# EAGLE design led strip controller (EAGLE 9.5.2)
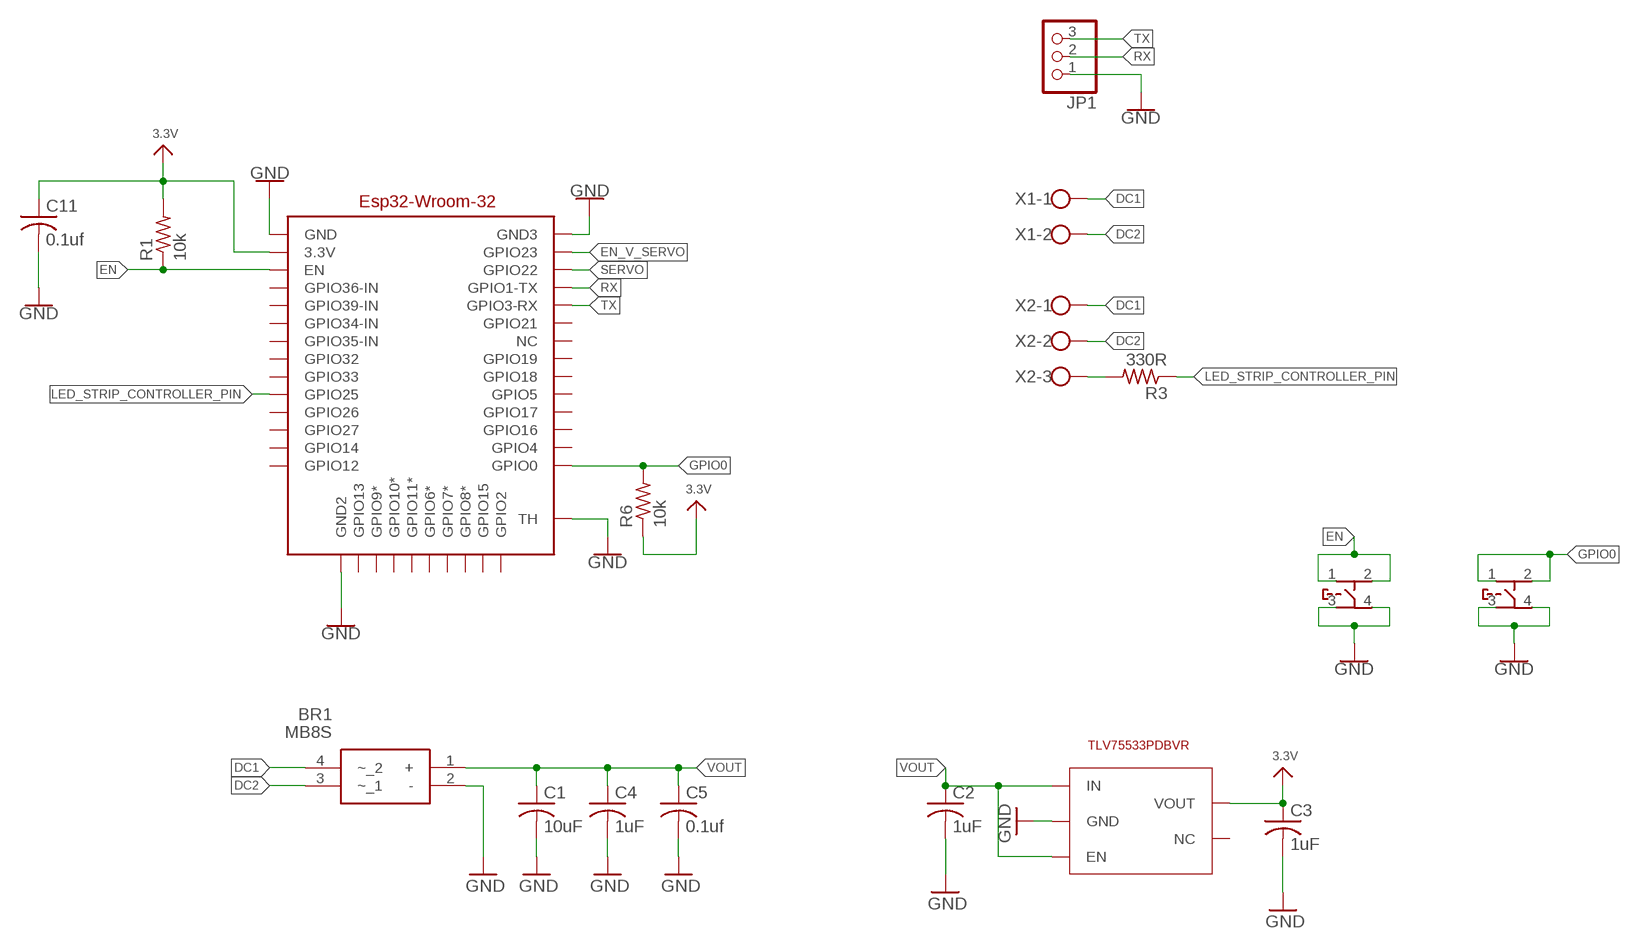
[diagram p0: schematic, sheet 1]

## Parts
BR1  MB8S  [SOP245P670X290-4N]
C1  10uF  C-USC1206  [C1206]
C2  1uF  C-USC0603  [C0603]
C3  1uF  C-USC0603  [C0603]
C4  1uF  C-USC0603  [C0603]
C5  0.1uf  C-USC0603  [C0603]
C11  0.1uf  C-USC0603  [C0603]
JP1  PINHD-1X3  [1X03]
R1  10k  R-US_R0603  [R0603]
R3  330R  R-US_R0603  [R0603]
R6  10k  R-US_R0603  [R0603]
U$1  ESP32-WROM-32  [ESP-32FOOTPRINT]
U$29  TLV75533PDBVR  [SOT-23-5]
U$33  XUNPU  [TS-1089S]
U$34  XUNPU  [TS-1089S]
X1  W237-102  [W237-102]
X2  W237-103  [W237-103]

## Nets
3.3V: C3.1 C11.1 R1.2 R6.1 U$1.3.3V U$29.VOUT
DC1: BR1.4(~_2) X1.1 X2.1
DC2: BR1.3(~_1) X1.2 X2.2
EN: R1.1 U$1.EN U$33.1 U$33.2
EN_V_SERVO: U$1.GPIO23
GND: BR1.2(-) C1.2 C2.2 C3.2 C4.2 C5.2 C11.2 JP1.1 U$1.GND U$1.GND2 U$1.GND3 U$1.TH U$29.GND U$33.3 U$33.4 U$34.3 U$34.4
GPIO0: R6.2 U$1.GPIO0 U$34.1 U$34.2
LED_STRIP_CONTROLLER_PIN: R3.1 U$1.GPIO25
N$1: R3.2 X2.3
RX: JP1.2 U$1.GPIO1(GPIO1-TX)
SERVO: U$1.GPO22(GPIO22)
TX: JP1.3 U$1.GPIO3(GPIO3-RX)
VOUT: BR1.1(+) C1.1 C2.1 C4.1 C5.1 U$29.EN U$29.IN
Unconnected: U$1.GPIO2 U$1.GPIO4 U$1.GPIO5 U$1.GPIO6(GPIO6*) U$1.GPIO7(GPIO7*) U$1.GPIO8(GPIO8*) U$1.GPIO9(GPIO9*) U$1.GPIO10(GPIO10*) U$1.GPIO11(GPIO11*) U$1.GPIO12 U$1.GPIO13 U$1.GPIO14 U$1.GPIO15 U$1.GPIO16 U$1.GPIO17 U$1.GPIO18 U$1.GPIO19 U$1.GPIO21 U$1.GPIO26 U$1.GPIO27 U$1.GPIO32 U$1.GPIO33 U$1.GPIO34(GPIO34-IN) U$1.GPIO35(GPIO35-IN) U$1.GPIO36(GPIO36-IN) U$1.GPIO39(GPIO39-IN) U$1.NC U$29.NC

## Notes on the sheet
- TLV75533PDBVR

## Library data of the parts
BR1 = MB8S:MB8S: ON Semiconductor MB8S, Bridge Rectifier, 500mA 800V, 4-Pin SOIC Source: Datasheet <https://www.onsemi.com/pub/Collateral/MB8S-D.PDF>; ARROW_PART_NUMBER: MB8S; ARROW_PRICE-STOCK: https://www.arrow.com/en/products/mb8s/on-semiconductor?region=nac; DESCRIPTION: ON Semiconductor MB8S, Bridge Rectifier, 500mA 800V, 4-Pin SOIC; HEIGHT: 2.9mm; MANUFACTURER_NAME: onsemi; MANUFACTURER_PART_NUMBER: MB8S; MOUSER_PART_NUMBER: 512-MB8S; MOUSER_PRICE-STOCK: https://www.mouser.co.uk/ProductDetail/ON-Semiconductor-Fairchild/MB8S?qs=5V%252BoiEcutOGeoeDaI1GueA%3D%3D
C1 = BeagleBone_Black_Wireless:C-US: CAPACITOR, American symbol
C2-C5 C11 = rcl:C-US: CAPACITOR, American symbol; SPICEPREFIX: C
JP1 = pinhead:PINHD-1X3: PIN HEADER
R1 R6 = adafruit:R-US_: RESISTOR, American symbol
R3 = rcl:R-US_: RESISTOR, American symbol; SPICEPREFIX: R
U$1 = Esp32-wrom-32:ESP32-WROM-32
U$29 = TLV75533PDBVR:TLV75533PDBVR
U$33 U$34 = TS-1089S-02526:XUNPU
X1 = con-wago-500:W237-102: WAGO SCREW CLAMP; MPN: 237-102; OC_FARNELL: unknown; OC_NEWARK: 70K9898
X2 = con-wago-500:W237-103: WAGO SCREW CLAMP; MPN: 237-103; OC_FARNELL: unknown; OC_NEWARK: 18M7116

## Board
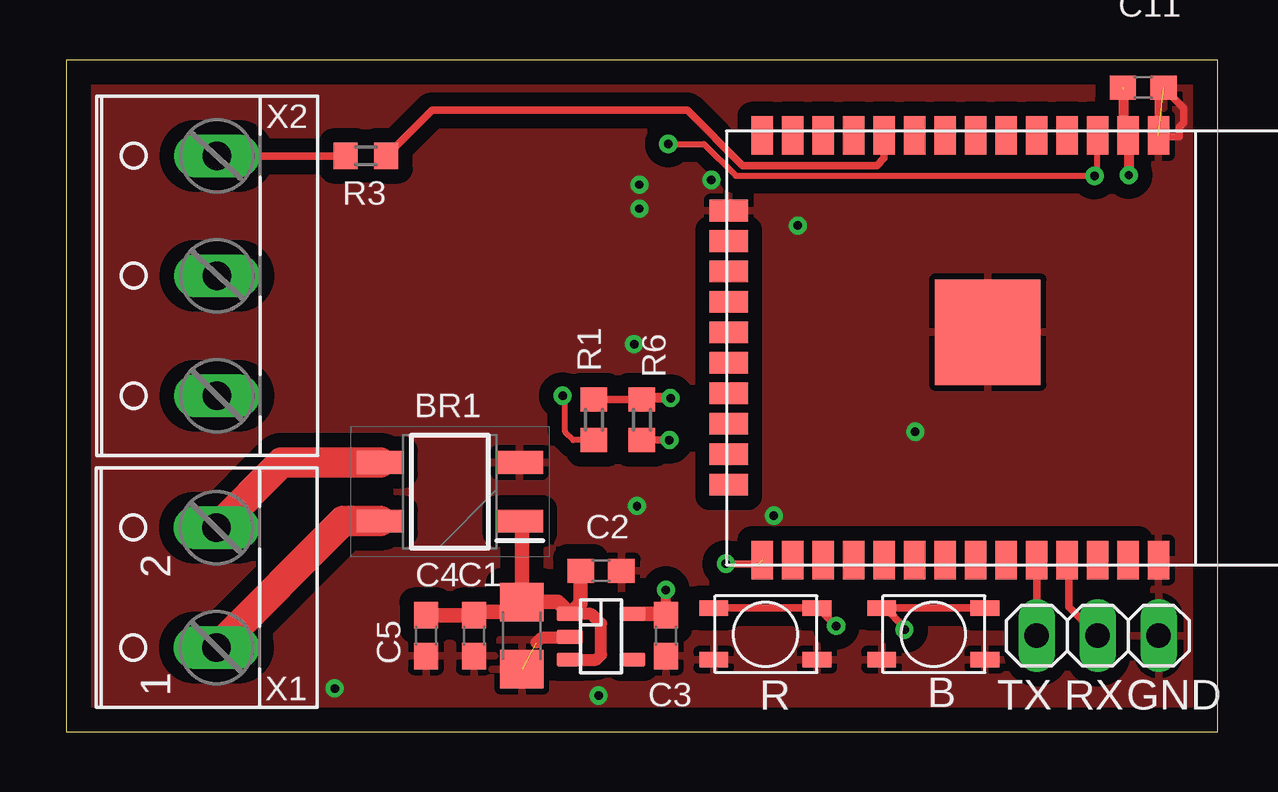
[diagram p1: board, top side]
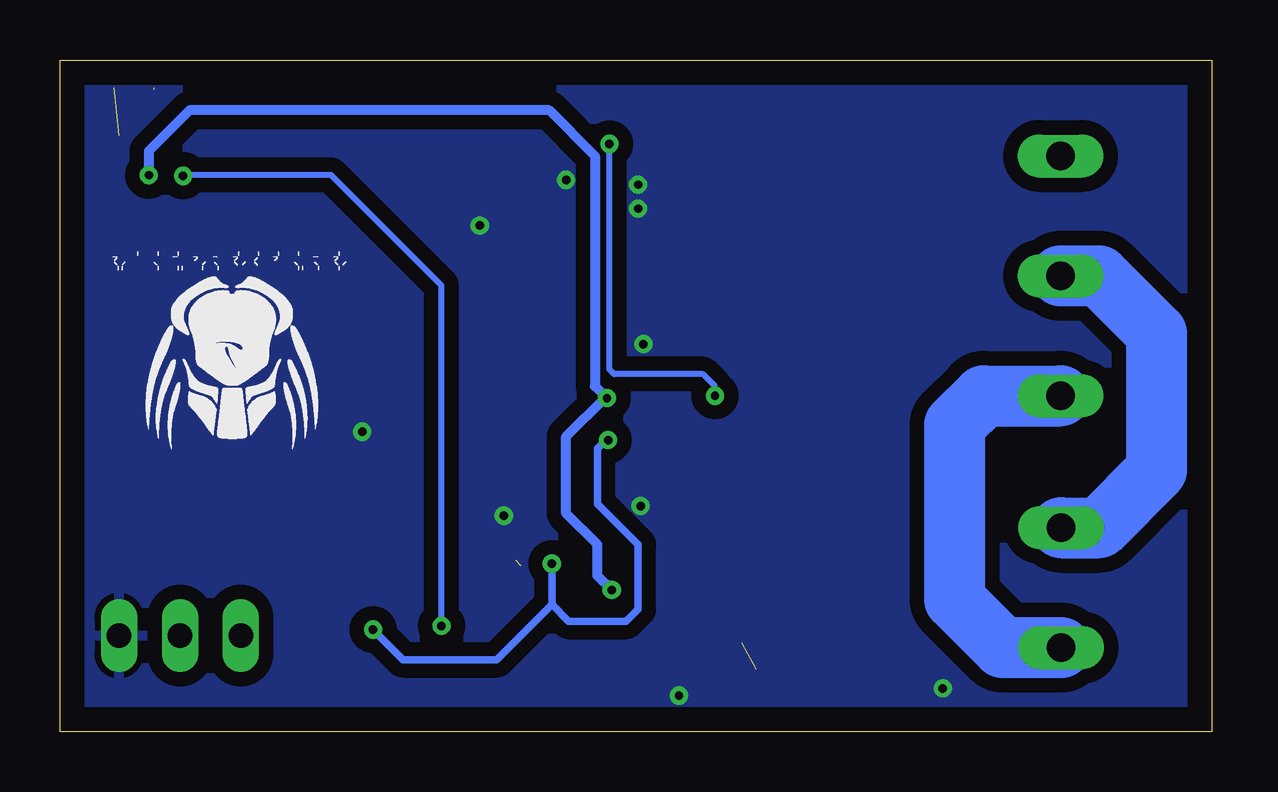
[diagram p2: board, bottom side, seen from below]

Size 48 x 28 mm. Coordinates in mm from the lower left corner, seen from the top.
Outline: 0,0 48,0 48,28 0,28 0,0
Copper layers (1*16): Top 0.035mm / dielectric 1.5mm / Bottom 0.035mm
Design rules "default *": minimum track width 6mil, minimum drill 0.35mm, track to track 6mil, track to pad 6mil, pad to pad 6mil, via to via 6mil, smd to smd 6mil, copper to edge 40mil, drill to drill 6mil, minimum pad ring 10mil, minimum via ring 8mil, stop-mask expansion 4mil, vias tented up to drill 16mil, thermal gap 10mil

### Footprints (pad centres in the part's own frame; a part is rotated, then mirrored left to right if it is on the bottom)
SOP245P670X290-4N = smd 1.925 x 0.95: 1 -2.912,1.225; 2 -2.912,-1.225; 3 2.912,-1.225; 4 2.912,1.225
C1206 = smd 1.6 x 1.8: 1 -1.4,0; 2 1.4,0
C0603 = smd 1.1 x 1: 1 -0.85,0; 2 0.85,0
1X03 = drill 1.016 long: 1 -2.54,0; 2 0,0; 3 2.54,0
R0603 = smd 1 x 1.1: 1 -0.85,0; 2 0.85,0
ESP-32FOOTPRINT = smd 1.6 x 0.9: 3.3V -0.1,16.74; EN -0.1,15.47; GND -0.1,18.01; GND3 17.6,18.01; GPIO0 17.6,1.5; GPIO1 17.6,14.2; GPIO3 17.6,12.93; GPIO4 17.6,2.77; GPIO5 17.6,6.58; GPIO12 -0.1,1.5; GPIO14 -0.1,2.77; GPIO16 17.6,4.04; GPIO17 17.6,5.31; GPIO18 17.6,7.85; GPIO19 17.6,9.12; GPIO21 17.6,11.66; GPIO23 17.6,16.74; GPIO25 -0.1,6.58; GPIO26 -0.1,5.31; GPIO27 -0.1,4.04; GPIO32 -0.1,9.12; GPIO33 -0.1,7.85; GPIO34 -0.1,11.66; GPIO35 -0.1,10.39; GPIO36 -0.1,14.2; GPIO39 -0.1,12.93; GPO22 17.6,15.47; NC 17.6,10.39 | smd 0.9 x 1.6: GND2 3.03,0.1; GPIO2 14.46,0.1; GPIO6 9.38,0.1; GPIO7 10.65,0.1; GPIO8 11.92,0.1; GPIO9 5.57,0.1; GPIO10 6.84,0.1; GPIO11 8.11,0.1; GPIO13 4.3,0.1; GPIO15 13.19,0.1 | smd 4.4 x 4.4: TH 8.1,10.9
SOT-23-5 = smd 1.1 x 0.6: EN 0,0; GND 0,0.95; IN 0,1.9; NC 2.6,0; VOUT 2.6,1.9
TS-1089S = smd 1.2 x 0.65: 1 0,2.15; 2 4.3,2.15; 3 0,0; 4 4.3,0
W237-102 = drill 1.194 long: 1 -2.5,-1.27; 2 2.5,-1.27
W237-103 = drill 1.194 long: 1 -5,-1.29; 2 0,-1.29; 3 5,-1.29

### Placement (x,y rotation side)
BR1  16,10 180 top
C1  19,4 270 top
C2  22.3,6.7 0 top
C3  25,4 270 top
C4  17,4 270 top
C5  15,4 270 top
C11  44.9,26.85 0 top
JP1  43,4 180 top
R1  22,13 90 top
R3  12.5,24 180 top
R6  24,13 270 top
U$1  27.52,24.75 270 top
U$29  21,3 0 top
U$33  27,3 0 top
U$34  34,3 0 top
X1  5,6 90 top
X2  5,19 90 top

### Tracks (layer width: path | path; a pad name or v marks a point on that pad's centre or on a via)
3.3V  (via drill 0.35)  (1 unrouted)
  Top 0.305: R1.2 R6.1
  Top 0.406: v25.2,13.9 24.05,13.9 R6.1 | C3.1 v25,5.9 | v44.3,23.2 44.3,24.81 U$1.3.3V 44.1,25.01 44.1,26.78
  Top 0.61: U$29.VOUT 24.95,4.9 C3.1
  Bottom 0.406: v25,5.9 25.6,6.5 25.6,7.8 26.9,9.1 26.9,12.3 25.25,13.95 v25.2,13.9 25.7,14.4 25.7,24 27.6,25.9 42.6,25.9 44.3,24.2 v44.3,23.2
DC1
  Top 1.27: X1.1 11.54,8.78 BR1.4
  Bottom 2.54: X1.1 8.7,3.5 10.7,5.5 10.7,12.8 9.5,14 X2.1
DC2
  Top 1.27: X1.2 8.99,11.22 BR1.3
  Bottom 2.54: X1.2 4.69,8.5 2.29,10.9 2.29,16.6 4.69,19 X2.2
EN  (via drill 0.35)
  Top 0.254: R1.1 21.15,12.15 20.8,12.5 20.8,14 v20.7,14 | v25.1,24.5 26.59,24.5 27.92,23.17 v42.87,23.17 42.99,23.29 U$1.EN
  Top 0.305: U$33.1 U$33.2 31.35,5.15 v32.1,4.4
  Bottom 0.254: v20.7,14 20.7,14.4 21.2,14.9 24.9,14.9 25.1,15.1 v25.1,24.5 | v32.1,4.4 32.1,18.6 36.7,23.2 42.6,23.2 42.63,23.17 v42.87,23.17
GND  (via drill 0.35)  (2 unrouted)
  Top 0.305: U$1.GND 45.53,26.61 45.75,26.83 46.59,25.99 46.59,25.39 46.4,25.2 46.4,24.8 45.58,24.8 U$1.GND
  Top 0.508: U$29.GND 20.95,3.9 19.8,3.9 19.6,3.7
  other vias: 23.8,9.4 11.2,1.8 30.5,21.1 35.4,12.5 22.2,1.5 26.9,23 23.9,22.8 23.9,21.8 23.68,16.15 29.5,9
  pour Top (isolate 0.6): -5,29 49,29 49,-1 -5,-1
  pour Bottom (isolate 0.6): -5,29 49,29 49,-1 -5,-1
GPIO0  (via drill 0.35)  (1 unrouted)
  Top 0.305: U$34.1 U$34.2 | 28.8,6.93 28.8,6.8 | 34,5.3 U$34.1 | U$34.1 34.15,5.15 34.95,4.35 v34.95,4.25 | v27.5,7 28.87,7 U$1.GPIO0 | v25.15,12.15 R6.2
  Bottom 0.305: v34.95,4.25 33.7,3 29.8,3 27.5,5.3 | v27.5,7 27.5,5.3 | v25.15,12.15 25.2,12.2 25.6,11.8 25.6,9.5 23.9,7.8 23.9,5.1 24.4,4.6 26.8,4.6 27.5,5.3
LED_STRIP_CONTROLLER_PIN
  Top 0.305: U$1.GPIO25 34.1,23.9 33.8,23.6 28.2,23.6 25.9,25.9 15.25,25.9 R3.1
N$1
  Top 0.305: X2.3 R3.2
RX
  Top 0.305: U$1.GPIO1 41.8,7.07 41.8,5.2 JP1.2
TX
  Top 0.305: JP1.3 U$1.GPIO3
VOUT
  Top 0.508: U$29.EN 22.1,3 22.3,3.2 22.3,4.5 21.9,4.9 U$29.IN
  Top 0.61: C5.1 C4.1 17.15,5 19,5 C1.1 | BR1.1 19,8.69 C1.1 | C1.1 20.5,5.4 U$29.IN 21.45,5.35 C2.1

### Text on the board
tPlace: R | B | TX | RX | GND